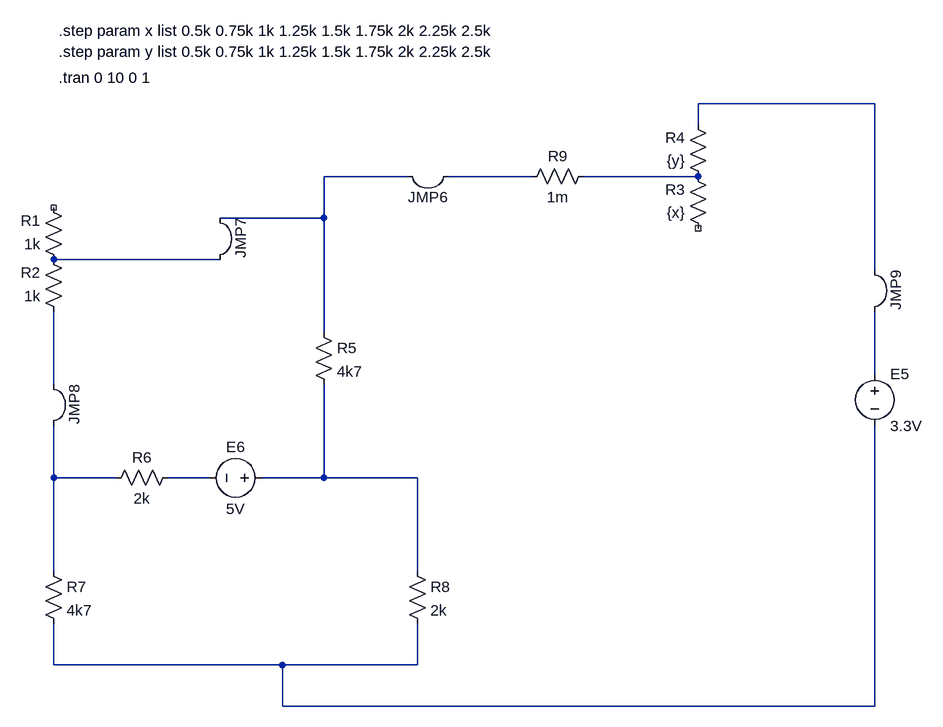
[diagram p0: schematic Draft2.asc]
Draft2.asc, the LTspice schematic file:
Version 4.1
SHEET 1 1392 680
WIRE 1312 -464 1040 -464
WIRE 1040 -432 1040 -464
WIRE 592 -352 464 -352
WIRE 784 -352 656 -352
WIRE 1040 -352 864 -352
WIRE 464 -288 464 -352
WIRE 464 -288 304 -288
WIRE 304 -224 48 -224
WIRE 1312 -208 1312 -464
WIRE 464 -112 464 -288
WIRE 1312 -48 1312 -144
WIRE 48 -32 48 -144
WIRE 48 112 48 32
WIRE 144 112 48 112
WIRE 288 112 224 112
WIRE 464 112 464 -32
WIRE 464 112 368 112
WIRE 608 112 464 112
WIRE 48 256 48 112
WIRE 608 256 608 112
WIRE 48 400 48 336
WIRE 400 400 48 400
WIRE 608 400 608 336
WIRE 608 400 400 400
WIRE 400 464 400 400
WIRE 1312 464 1312 32
WIRE 1312 464 400 464
SYMBOL res 32 240 R0
SYMATTR InstName R7
SYMATTR Value 4k7
SYMBOL res 592 240 R0
SYMATTR InstName R8
SYMATTR Value 2k
SYMBOL res 448 -128 R0
SYMATTR InstName R5
SYMATTR Value 4k7
SYMBOL res 240 96 R90
WINDOW 0 0 56 VBottom 2
WINDOW 3 32 56 VTop 2
SYMATTR InstName R6
SYMATTR Value 2k
SYMBOL res 880 -368 R90
WINDOW 0 0 56 VBottom 2
WINDOW 3 32 56 VTop 2
SYMATTR InstName R9
SYMATTR Value 1m
SYMBOL res 64 -128 R180
WINDOW 0 36 76 Left 2
WINDOW 3 36 40 Left 2
SYMATTR InstName R2
SYMATTR Value 1k
SYMBOL res 64 -208 R180
WINDOW 0 36 76 Left 2
WINDOW 3 36 40 Left 2
SYMATTR InstName R1
SYMATTR Value 1k
SYMBOL res 1056 -256 R180
WINDOW 0 36 76 Left 2
WINDOW 3 36 40 Left 2
SYMATTR InstName R3
SYMATTR Value {x}
SYMBOL res 1056 -336 R180
WINDOW 0 36 76 Left 2
WINDOW 3 36 40 Left 2
SYMATTR InstName R4
SYMATTR Value {y}
SYMBOL voltage 384 112 R90
WINDOW 0 -32 56 VBottom 2
WINDOW 3 32 56 VTop 2
SYMATTR InstName E6
SYMATTR Value 5V
SYMBOL voltage 1312 -64 R0
SYMATTR InstName E5
SYMATTR Value 3.3V
SYMBOL Misc\\jumper 112 0 M270
SYMATTR InstName JMP8
SYMBOL Misc\\jumper 368 -256 M270
SYMATTR InstName JMP7
SYMBOL Misc\\jumper 624 -288 M180
SYMATTR InstName JMP6
SYMBOL Misc\\jumper 1376 -176 M270
SYMATTR InstName JMP9
TEXT 56 -504 Left 2 !.tran 0 10 0 1
TEXT 56 -576 Left 2 !.step param x list 0.5k 0.75k 1k 1.25k 1.5k 1.75k 2k 2.25k 2.5k
TEXT 56 -544 Left 2 !.step param y list 0.5k 0.75k 1k 1.25k 1.5k 1.75k 2k 2.25k 2.5k

The netlist it stands for:
* Draft2.asc
R7 N004 N007 4k7
R8 N006 N007 2k
R5 N002 N006 4k7
R6 N005 N004 2k
R9 N003 N002 1m
R2 N004 N002 1k
R1 N002 NC_01 1k
R3 NC_02 N003 {x}
R4 N003 N001 {y}
V§E6 N006 N005 5V
V§E5 N001 N007 3.3V
.tran 0 10 0 1
.step param x list 0.5k 0.75k 1k 1.25k 1.5k 1.75k 2k 2.25k 2.5k
.step param y list 0.5k 0.75k 1k 1.25k 1.5k 1.75k 2k 2.25k 2.5k
.backanno
.end